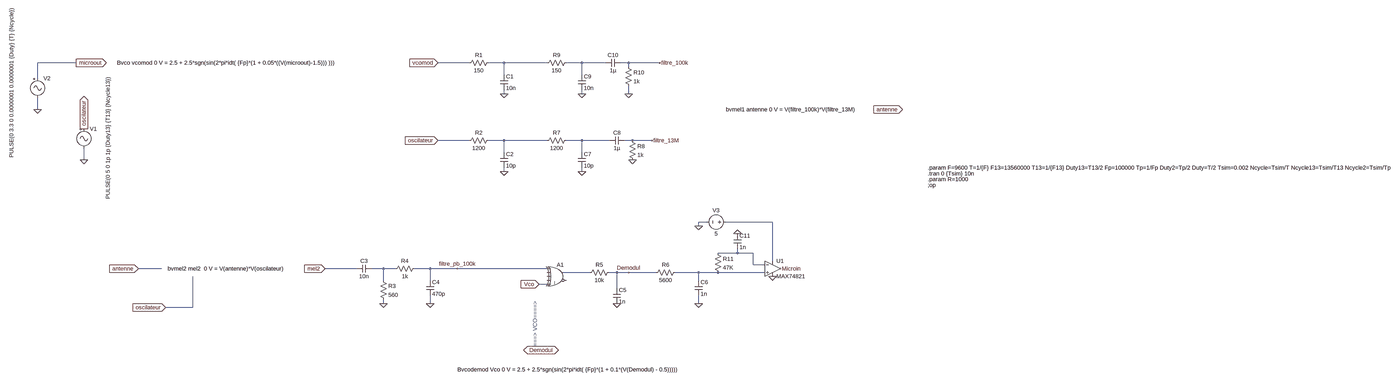
[diagram p0: schematic schémas final.asc, whole sheet]
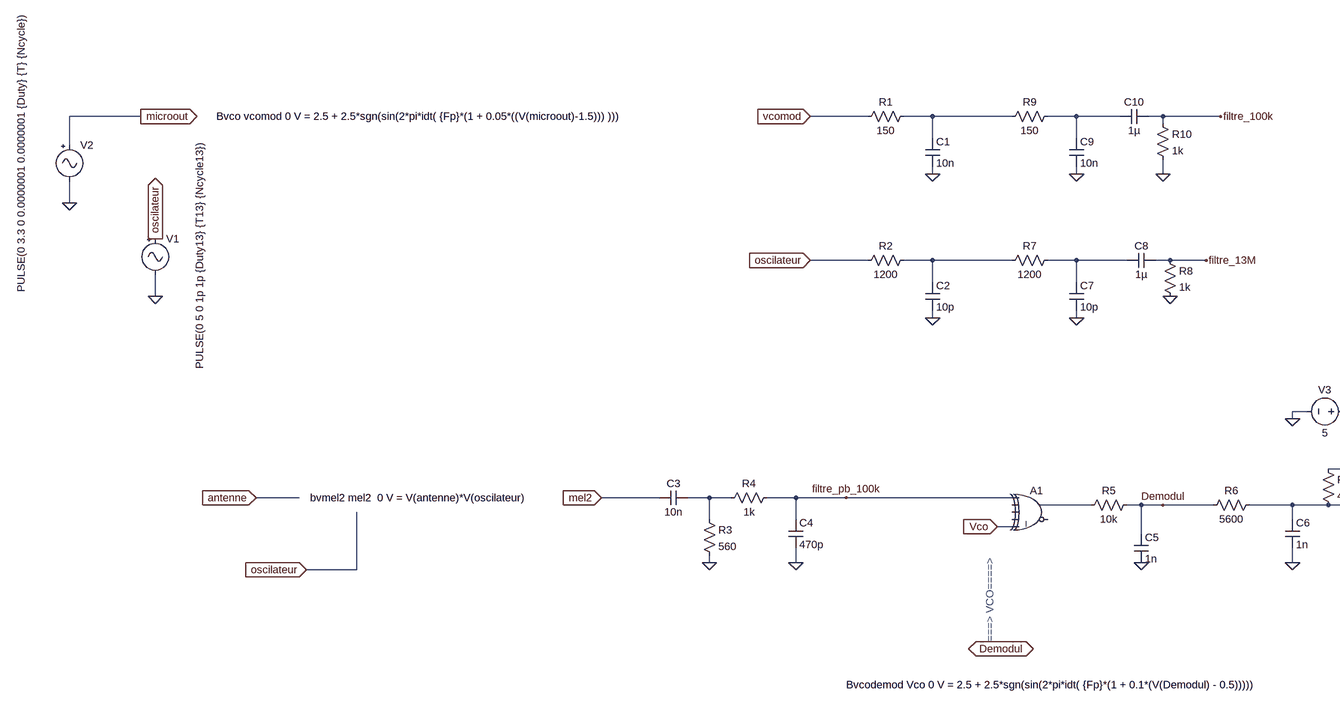
[diagram p1: schematic schémas final.asc, part, row 1 of 1, column 1 of 2]
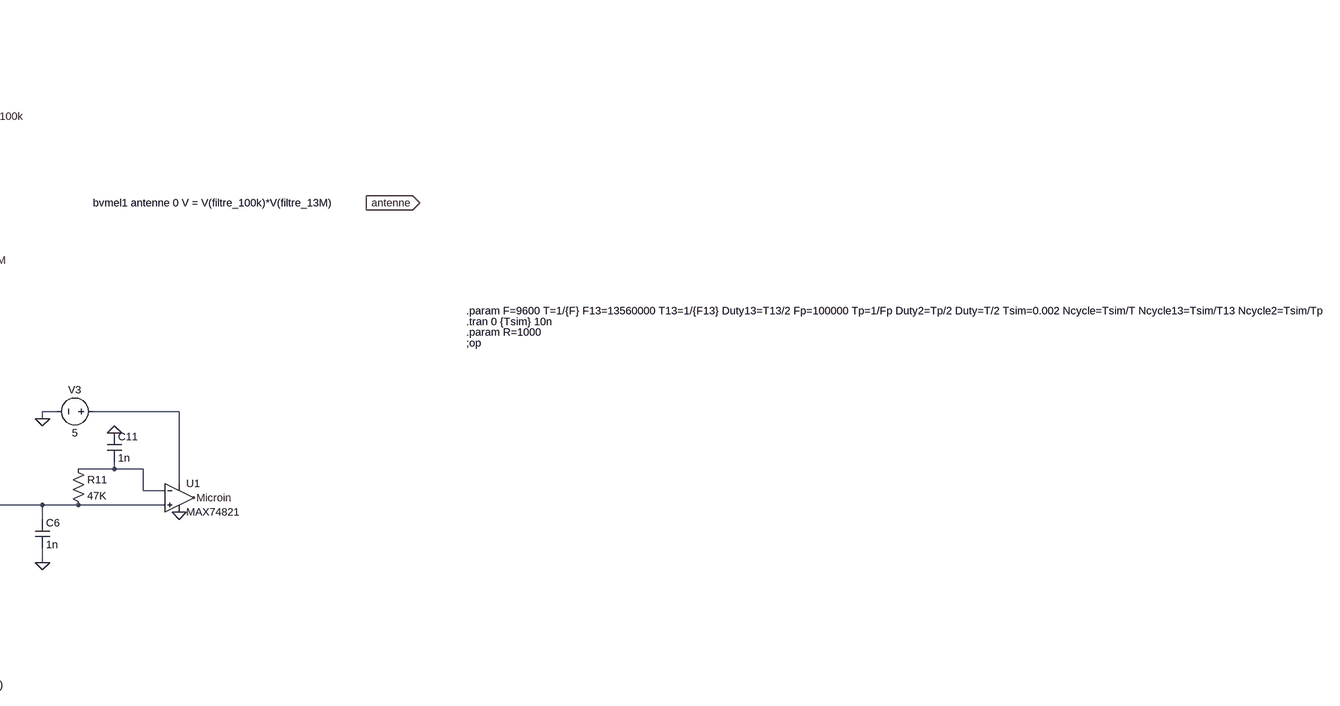
[diagram p2: schematic schémas final.asc, part, row 1 of 1, column 2 of 2]
schémas final.asc, the LTspice schematic file:
Version 4.1
SHEET 1 5668 1376
WIRE -480 96 -752 96
WIRE 1136 96 1008 96
WIRE 1280 96 1216 96
WIRE 1456 96 1280 96
WIRE 1600 96 1536 96
WIRE 1696 96 1600 96
WIRE 1792 96 1760 96
WIRE 1920 96 1792 96
WIRE 1792 112 1792 96
WIRE 1280 144 1280 96
WIRE 1600 144 1600 96
WIRE -752 160 -752 96
WIRE 1280 224 1280 208
WIRE 1600 224 1600 208
WIRE 1792 224 1792 192
WIRE -752 288 -752 240
WIRE 1136 416 1008 416
WIRE 1280 416 1216 416
WIRE 1456 416 1280 416
WIRE 1600 416 1536 416
WIRE 1712 416 1600 416
WIRE 1808 416 1776 416
WIRE 1888 416 1808 416
WIRE 1280 464 1280 416
WIRE 1600 464 1600 416
WIRE -448 496 -448 448
WIRE 1280 544 1280 528
WIRE 1600 544 1600 528
WIRE 2112 752 2080 752
WIRE 2384 752 2192 752
WIRE 2080 768 2080 752
WIRE 2240 880 2240 864
WIRE 2240 880 2160 880
WIRE 2304 880 2240 880
WIRE 2384 912 2384 752
WIRE 2304 928 2304 880
WIRE 2352 928 2304 928
WIRE -128 944 -224 944
WIRE 672 944 544 944
WIRE 784 944 736 944
WIRE 832 944 784 944
WIRE 976 944 912 944
WIRE 1088 944 976 944
WIRE 1456 944 1088 944
WIRE 1632 960 1520 960
WIRE 1744 960 1712 960
WIRE 1792 960 1744 960
WIRE 1904 960 1792 960
WIRE 2080 960 1984 960
WIRE 2160 960 2080 960
WIRE 2352 960 2160 960
WIRE 784 992 784 944
WIRE 976 992 976 944
WIRE 2080 992 2080 960
WIRE 1456 1008 1424 1008
WIRE 1744 1024 1744 960
WIRE 784 1088 784 1072
WIRE 976 1088 976 1056
WIRE 2080 1088 2080 1056
WIRE 0 1104 0 976
WIRE 0 1104 -112 1104
FLAG 1008 96 vcomod
IOPIN 1008 96 In
FLAG -480 96 microout
IOPIN -480 96 Out
FLAG 1280 224 0
FLAG 1920 96 filtre_100k
FLAG 1008 416 oscilateur
IOPIN 1008 416 In
FLAG 1280 544 0
FLAG 2800 288 antenne
IOPIN 2800 288 Out
FLAG -112 1104 oscilateur
IOPIN -112 1104 In
FLAG 544 944 mel2
IOPIN 544 944 In
FLAG 784 1088 0
FLAG 976 1088 0
FLAG 1088 944 filtre_pb_100k
FLAG 1792 960 Demodul
FLAG 1424 1008 Vco
IOPIN 1424 1008 In
FLAG 1744 1088 0
FLAG 1360 1280 Demodul
IOPIN 1360 1280 BiDir
FLAG 2080 1088 0
FLAG -448 496 0
FLAG -448 368 oscilateur
IOPIN -448 368 Out
FLAG -752 288 0
FLAG 1600 544 0
FLAG 1808 496 0
FLAG 1600 224 0
FLAG 1792 224 0
FLAG 1888 416 filtre_13M
FLAG 2080 768 0
FLAG 2416 944 Microin
FLAG 2384 976 0
FLAG 2240 800 0
FLAG -224 944 antenne
IOPIN -224 944 In
SYMBOL res 1232 80 R90
WINDOW 0 0 56 VBottom 2
WINDOW 3 32 56 VTop 2
SYMATTR InstName R1
SYMATTR Value 150
SYMBOL cap 1264 144 R0
SYMATTR InstName C1
SYMATTR Value 10n
SYMBOL res 1232 400 R90
WINDOW 0 0 56 VBottom 2
WINDOW 3 32 56 VTop 2
SYMATTR InstName R2
SYMATTR Value 1200
SYMBOL cap 1264 464 R0
SYMATTR InstName C2
SYMATTR Value 10p
SYMBOL cap 736 928 R90
WINDOW 0 0 32 VBottom 2
WINDOW 3 32 32 VTop 2
SYMATTR InstName C3
SYMATTR Value 10n
SYMBOL res 768 976 R0
SYMATTR InstName R3
SYMATTR Value 560
SYMBOL res 928 928 R90
WINDOW 0 0 56 VBottom 2
WINDOW 3 32 56 VTop 2
SYMATTR InstName R4
SYMATTR Value 1k
SYMBOL cap 960 992 R0
SYMATTR InstName C4
SYMATTR Value 470p
SYMBOL Digital\\xor 1504 912 R0
SYMATTR InstName A1
SYMBOL res 1728 944 R90
WINDOW 0 0 56 VBottom 2
WINDOW 3 32 56 VTop 2
SYMATTR InstName R5
SYMATTR Value 10k
SYMBOL cap 1728 1024 R0
SYMATTR InstName C5
SYMATTR Value 1n
SYMBOL cap 2064 992 R0
SYMATTR InstName C6
SYMATTR Value 1n
SYMBOL res 2000 944 R90
WINDOW 0 0 56 VBottom 2
WINDOW 3 32 56 VTop 2
SYMATTR InstName R6
SYMATTR Value 5600
SYMBOL Misc\\signal -448 352 R0
WINDOW 123 0 0 Left 0
WINDOW 39 0 0 Left 0
WINDOW 3 99 -197 VRight 2
SYMATTR Value PULSE(0 5 0 1p 1p {Duty13} {T13} {Ncycle13})
SYMATTR InstName V1
SYMBOL Misc\\signal -752 144 R0
WINDOW 3 -107 -275 VRight 2
WINDOW 123 0 0 Left 0
WINDOW 39 0 0 Left 0
SYMATTR Value PULSE(0 3.3 0 0.0000001 0.0000001 {Duty} {T} {Ncycle})
SYMATTR InstName V2
SYMBOL res 1552 400 R90
WINDOW 0 0 56 VBottom 2
WINDOW 3 32 56 VTop 2
SYMATTR InstName R7
SYMATTR Value 1200
SYMBOL cap 1584 464 R0
SYMATTR InstName C7
SYMATTR Value 10p
SYMBOL cap 1776 400 R90
WINDOW 0 0 32 VBottom 2
WINDOW 3 32 32 VTop 2
SYMATTR InstName C8
SYMATTR Value 1µ
SYMBOL res 1792 400 R0
SYMATTR InstName R8
SYMATTR Value 1k
SYMBOL res 1552 80 R90
WINDOW 0 0 56 VBottom 2
WINDOW 3 32 56 VTop 2
SYMATTR InstName R9
SYMATTR Value 150
SYMBOL cap 1584 144 R0
SYMATTR InstName C9
SYMATTR Value 10n
SYMBOL cap 1760 80 R90
WINDOW 0 0 32 VBottom 2
WINDOW 3 32 32 VTop 2
SYMATTR InstName C10
SYMATTR Value 1µ
SYMBOL res 1776 96 R0
SYMATTR InstName R10
SYMATTR Value 1k
SYMBOL voltage 2208 752 R90
WINDOW 0 -32 56 VBottom 2
WINDOW 3 32 56 VTop 2
WINDOW 123 0 0 Left 0
WINDOW 39 0 0 Left 0
SYMATTR InstName V3
SYMATTR Value 5
SYMBOL OpAmps\\MAX74821 2384 880 R0
SYMATTR InstName U1
SYMBOL res 2144 864 R0
SYMATTR InstName R11
SYMATTR Value 47K
SYMBOL cap 2224 800 R0
SYMATTR InstName C11
SYMATTR Value 1n
TEXT -312 96 Left 2 !Bvco vcomod 0 V = 2.5 + 2.5*sgn(sin(2*pi*idt( {Fp}*(1 + 0.05*((V(microout)-1.5))) )))
TEXT 2192 288 Left 2 !bvmel1 antenne 0 V = V(filtre_100k)*V(filtre_13M)
TEXT -104 944 Left 2 !bvmel2 mel2  0 V = V(antenne)*V(oscilateur)
TEXT 1408 1264 VLeft 2 ;===> VCO====>
TEXT 1088 1360 Left 2 !Bvcodemod Vco 0 V = 2.5 + 2.5*sgn(sin(2*pi*idt( {Fp}*(1 + 0.1*(V(Demodul) - 0.5)))))
TEXT 3504 576 Left 2 !.param R=1000
TEXT 3504 600 Left 2 !;op
TEXT 3504 552 Left 2 !.tran 0 {Tsim} 10n
TEXT 3504 528 Left 2 !.param F=9600 T=1/{F} F13=13560000 T13=1/{F13} Duty13=T13/2 Fp=100000 Tp=1/Fp Duty2=Tp/2 Duty=T/2 Tsim=0.002 Ncycle=Tsim/T Ncycle13=Tsim/T13 Ncycle2=Tsim/Tp

The netlist it stands for:
* schémas final.asc
R1 N001 vcomod 150
C1 N001 0 10n
R2 N003 oscilateur 1200
C2 N003 0 10p
C3 N007 mel2 10n
R3 N007 0 560
R4 filtre_pb_100k N007 1k
C4 filtre_pb_100k 0 470p
A1 filtre_pb_100k 0 0 0 Vco 0 N008 0 XOR
R5 Demodul N008 10k
C5 Demodul 0 1n
C6 N009 0 1n
R6 N009 Demodul 5600
V1 oscilateur 0 PULSE(0 5 0 1p 1p {Duty13} {T13} {Ncycle13})
V2 microout 0 PULSE(0 3.3 0 0.0000001 0.0000001 {Duty} {T} {Ncycle})
R7 N004 N003 1200
C7 N004 0 10p
C8 filtre_13M N004 1µ
R8 filtre_13M 0 1k
R9 N002 N001 150
C9 N002 0 10n
C10 filtre_100k N002 1µ
R10 filtre_100k 0 1k
V3 N005 0 5
X§U1 N009 N006 N005 0 Microin MAX74821  ; pins In+ In- V+ V- OUT
R11 N006 N009 47K
C11 0 N006 1n
Bvco vcomod 0 V = 2.5 + 2.5*sgn(sin(2*pi*idt( {Fp}*(1 + 0.05*((V(microout)-1.5))) )))
bvmel1 antenne 0 V = V(filtre_100k)*V(filtre_13M)
bvmel2 mel2  0 V = V(antenne)*V(oscilateur)
* ===> VCO====>
Bvcodemod Vco 0 V = 2.5 + 2.5*sgn(sin(2*pi*idt( {Fp}*(1 + 0.1*(V(Demodul) - 0.5)))))
.param R=1000
;op
.tran 0 {Tsim} 10n
.param F=9600 T=1/{F} F13=13560000 T13=1/{F13} Duty13=T13/2 Fp=100000 Tp=1/Fp Duty2=Tp/2 Duty=T/2 Tsim=0.002 Ncycle=Tsim/T Ncycle13=Tsim/T13 Ncycle2=Tsim/Tp
.backanno
.end